# EAGLE schematic Motorsteuerung_op (EAGLE 9.5.1)
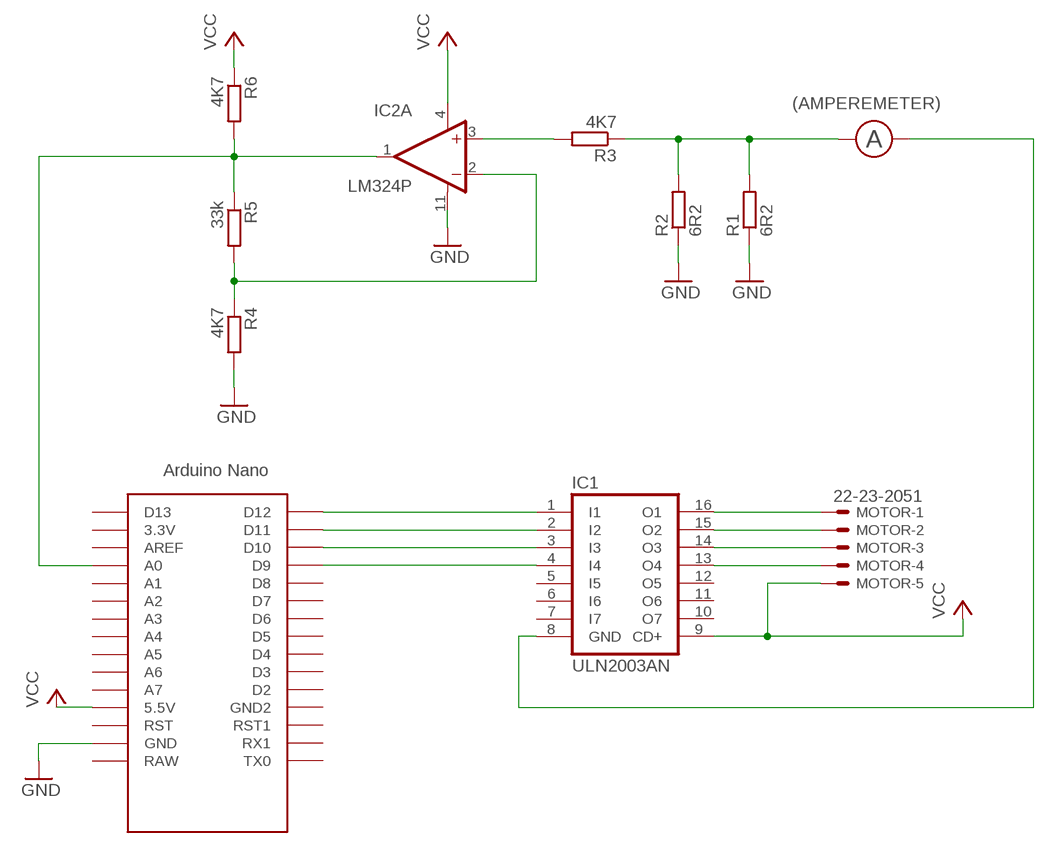
[diagram p0: schematic, sheet 1]

## Parts
(AMPEREMETER)  MESSGERAET  (no package)
IC1  ULN2003AN  [DIL16]
IC2  LM324P  [DIL14]
MOTOR  22-23-2051  [22-23-2051]
R1  6R2  R-EU_0207/10  [0207/10]
R2  6R2  R-EU_0207/10  [0207/10]
R3  4K7  R-EU_0207/10  [0207/10]
R4  4K7  R-EU_0207/10  [0207/10]
R5  33k  R-EU_0207/10  [0207/10]
R6  4K7  R-EU_0207/10  [0207/10]
U$1  NANO  [NANO]

## Nets
GND: IC2.11(A:V-) R1.1 R2.1 R4.2 U$1.GND
N$1: IC1.16(O1) MOTOR.1
N$2: IC1.1(I1) U$1.D12
N$3: IC1.2(I2) U$1.D11
N$4: IC1.3(I3) U$1.D10
N$5: IC1.4(I4) U$1.D9
N$6: IC1.15(O2) MOTOR.2
N$7: IC1.14(O3) MOTOR.3
N$8: IC1.13(O4) MOTOR.4
N$9: (AMPEREMETER).P$1 IC1.8(GND)
N$10: (AMPEREMETER).P$2 R1.2 R2.2 R3.1
N$17: IC2.3(A:+IN) R3.2
N$18: IC2.1(A:OUT) R5.1 R6.2 U$1.A0
N$19: IC2.2(A:-IN) R4.1 R5.2
VCC: IC1.9(CD+) IC2.4(A:V+) MOTOR.5 R6.1 U$1.5V(5.5V)
Unconnected: IC1.5(I5) IC1.6(I6) IC1.7(I7) IC1.10(O7) IC1.11(O6) IC1.12(O5) IC2.5(B:+IN) IC2.6(B:-IN) IC2.7(B:OUT) IC2.8(C:OUT) IC2.9(C:-IN) IC2.10(C:+IN) IC2.12(D:+IN) IC2.13(D:-IN) IC2.14(D:OUT) U$1.3.3V U$1.A1 U$1.A2 U$1.A3 U$1.A4 U$1.A5 U$1.A6 U$1.A7 U$1.AREF U$1.D2 U$1.D3 U$1.D4 U$1.D5 U$1.D6 U$1.D7 U$1.D8 U$1.D13 U$1.GND1(GND2) U$1.ICSP1 U$1.ICSP2 U$1.ICSP3 U$1.ICSP4 U$1.ICSP5 U$1.ICSP6 U$1.RAW U$1.RST U$1.RST1 U$1.RX1 U$1.TX0

## Library data of the parts
(AMPEREMETER) = luani_docuSymbol:MESSGERAET: Messgerät Bezeichnung: Attribut "Typ"; TYP: A; _EXTERNAL_: 0
IC1 = uln-udn:ULN2003A: DRIVER ARRAY
IC2 = lm324:LM324: Low Power, Precision FET-Input Operational Amplifiers
MOTOR = con-molex:22-23-2051: .100" (2.54mm) Center Header - 5 Pin; MF: MOLEX; MPN: 22-23-2051; OC_FARNELL: 1462952; OC_NEWARK: 38C9178
R1-R6 = rcl:R-EU_: RESISTOR, European symbol; SPICEPREFIX: R
U$1 = Arduino-clone:NANO: Arduino Nano